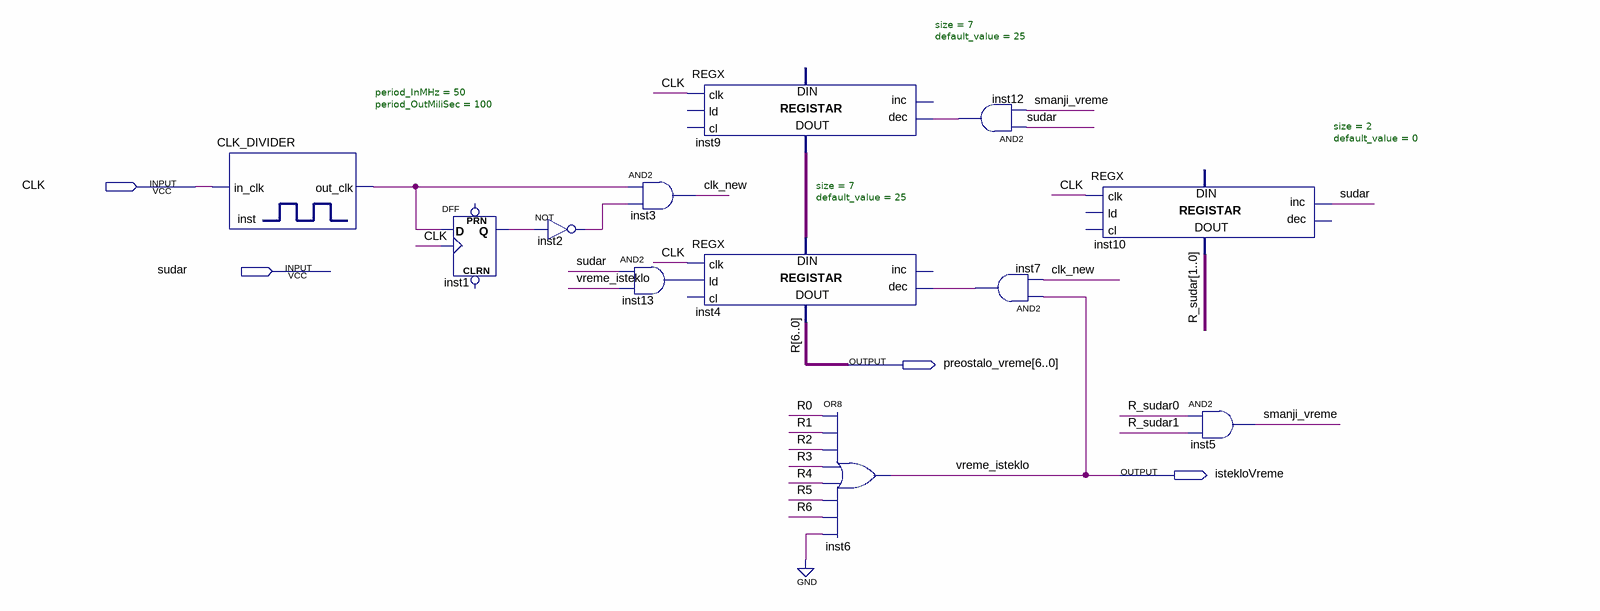
[diagram p0: schematic sheet]
// Quartus schematic Tajmer.bdf as structural Verilog: 12 symbols, 4 pins
module Tajmer (
  input  CLK,
  input  sudar,
  output [6:0] preostalo_vreme,
  output istekloVreme
);

  wire clk_new, inst1_q, inst2_out, inst7_out, inst12_out, inst13_out, inst_out_clk, smanji_vreme;
  wire [1:0] R_sudar;
  wire [6:0] inst9_data_out;

  CLK_DIVIDER #(.period_InMHz(50), .period_OutMiliSec(100)) inst (.in_clk(CLK), .out_clk(inst_out_clk));
  DFF inst1 (.CLK(CLK), .D(inst_out_clk), .Q(inst1_q));  // open: CLRN, PRN
  not inst2 (inst2_out, inst1_q);
  and inst3 (clk_new, inst_out_clk, inst2_out);
  and inst13 (inst13_out, sudar, istekloVreme);
  REGX #(.size(7), .default_value(25)) inst9 (
    .clk(CLK), .dec(inst12_out), .data_out(inst9_data_out));  // open: ld, cl, inc, data_in
  REGX #(.size(7), .default_value(25)) inst4 (
    .clk(CLK), .ld(inst13_out), .dec(inst7_out), .data_in(inst9_data_out), .data_out(preostalo_vreme));  // open: cl, inc
  or inst6 (istekloVreme, preostalo_vreme[0], preostalo_vreme[1], preostalo_vreme[2], preostalo_vreme[3], preostalo_vreme[4], preostalo_vreme[5], preostalo_vreme[6], 1'b0);
  and inst12 (inst12_out, sudar, smanji_vreme);
  and inst7 (inst7_out, istekloVreme, clk_new);
  REGX #(.size(2), .default_value(0)) inst10 (
    .clk(CLK), .inc(sudar), .data_out(R_sudar));  // open: ld, cl, dec, data_in
  and inst5 (smanji_vreme, R_sudar[0], R_sudar[1]);

  // Other names for the same wires on the sheet: R[6:0] = preostalo_vreme; R0 = preostalo_vreme[0];
  //   R1 = preostalo_vreme[1]; R2 = preostalo_vreme[2]; R3 = preostalo_vreme[3]; R4 = preostalo_vreme[4];
  //   R5 = preostalo_vreme[5]; R6 = preostalo_vreme[6]; vreme_isteklo = istekloVreme
endmodule
